# Altium schematic sheet POWER_IN_TYPE_C.SchDoc
size 209 x 297 mm; SheetNumber: 13; SheetTotal: 23
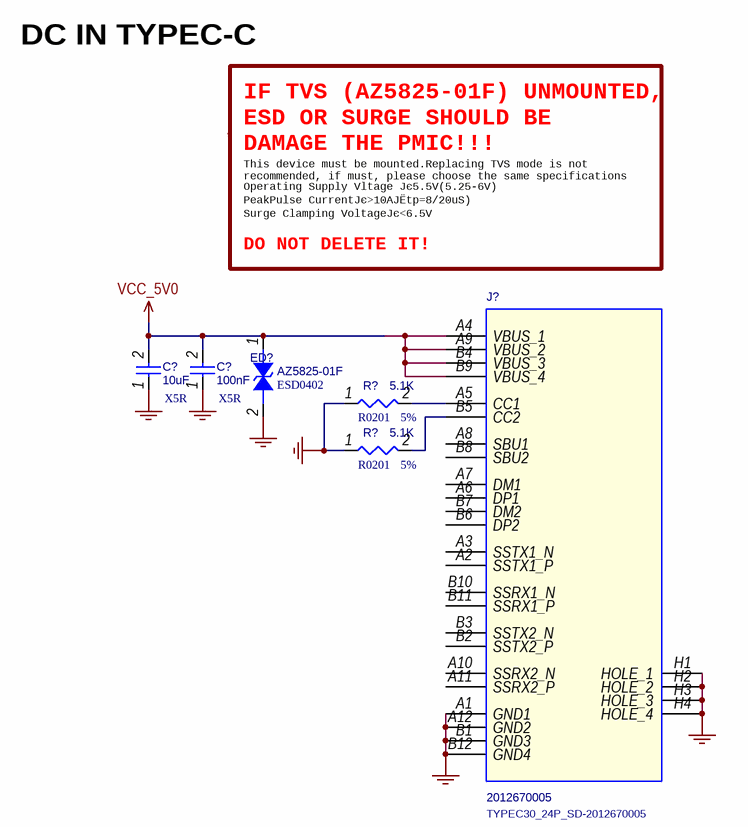
[diagram p0: POWER_IN_TYPE_C.SchDoc]

## Parts
(Parts that share a designator on the sheet are numbered #1, #2 ... from top to bottom, then left to right.)
C?#1  10uF  Dielectric: X5R  [C0201]
C?#2  100nF  Dielectric: X5R  [C0201]
ED?  AZ5825-01F  [ESD0402]
J?  2012670005  [TYPEC30_24P_SD-2012670005]
R?#1  5.1K  Tolerance: 5%  PCB Footprint: R0201  [R0402]
R?#2  5.1K  Tolerance: 5%  PCB Footprint: R0201  [R0402]

## Nets
GND: C?#1.1 C?#2.1 ED?.2 J?.A1(GND1) J?.A12(GND2) J?.B1(GND3) J?.B12(GND4) J?.H1(HOLE_1) J?.H2(HOLE_2) J?.H3(HOLE_3) J?.H4(HOLE_4) R?#1.1 R?#2.1
VCC_5V0: C?#1.2 C?#2.2 ED?.1 J?.A4(VBUS_1) J?.A9(VBUS_2) J?.B4(VBUS_3) J?.B9(VBUS_4)
NetJ?_A5: J?.A5(CC1) R?#1.2
NetJ?_B5: J?.B5(CC2) R?#2.2

Not connected (* = marked no-connect by the designer): J? A2(SSTX1_P) A3(SSTX1_N) A6(DP1) A7(DM1) A8(SBU1) A10(SSRX2_N) A11(SSRX2_P) B2(SSTX2_P) B3(SSTX2_N) B6(DP2) B7(DM2) B8(SBU2) B10(SSRX1_N) B11(SSRX1_P)

## Notes on the sheet
- DC IN TYPEC-C
- Operating Supply Vltage Јє5.5V(5.25-6V)
- PeakPulse CurrentЈє>10AЈЁtp=8/20uS)
- This device must be mounted.Replacing TVS mode is not
  recommended, if must, please choose the same specifications
- IF TVS (AZ5825-01F) UNMOUNTED,
  ESD OR SURGE SHOULD BE
  DAMAGE THE PMIC!!!
- Surge Clamping VoltageЈє<6.5V
- DO NOT DELETE IT!
- 297x210
- Формат А4

## Library data of the parts
C?#1 = CAP NP_Dup1: cap,10.00uF,+/-10%; Part Reference: C2600; Manufacturer: TDK; RK PN: C0603X5R0J104K030BC; Priority: A; Tolerance: 10%; Value: 10uF; Part Type: C0201; Manufacturer PN: C0603X5R0J104K030BC; Created by: JJJ
C?#2 = CAP NP_Dup1: cap,100.00nF,+/-10%; Part Reference: C2600; Manufacturer: TDK; RK PN: C0603X5R0J104K030BC; Priority: A; Tolerance: 10%; Value: 100nF; Part Type: C0201; Manufacturer PN: C0603X5R0J104K030BC; Created by: JJJ
ED? = DIODE BI_DIR TRIG: Transient Voltage Suppressing Device.Tiny Packge for ESD/Transient Protection; Part Reference: ED2200; Manufacturer: AmazingЈЁѕ§мНїЖјјЈ©; Priority: A; PCB Footprint: ESD0402; Value: AZ5825-01F; RK PN: AZ5825-01F; Part Type: ESD_TVS; Manufacturer PN: AZ5825-01F; Created by: JJJ
J? = USB31_TYPE_C_24P: USB Type-CОФКЅДёЧщ,МщєёЈ¬USB3.1ЅУїЪ; Part Reference: J2600; Manufacturer: MOLEX; RK PN: SD-105450-001; Priority: A; PCB Footprint: TYPEC30_24P_SD-2012670005; Value: 2012670005; Part Type: USB Jack; Manufacturer Part Number: SD-105450-001; Created by: YWQ
R?#1 R?#2 = RESISTOR_Dup2: НЁУГєсД¤µзЧи,0R,+/-5%,R0201,1/20W.; Part Reference: R2609; Manufacturer PN: RC0201JR-070RL; Manufacturer: YAGEO; Wattage: 1/20W; Priority: A; Value: 5.1K; Created by: YTL; Part Type: НЁУГєсД¤µзЧи; RK PN: RC0201JR-070RL